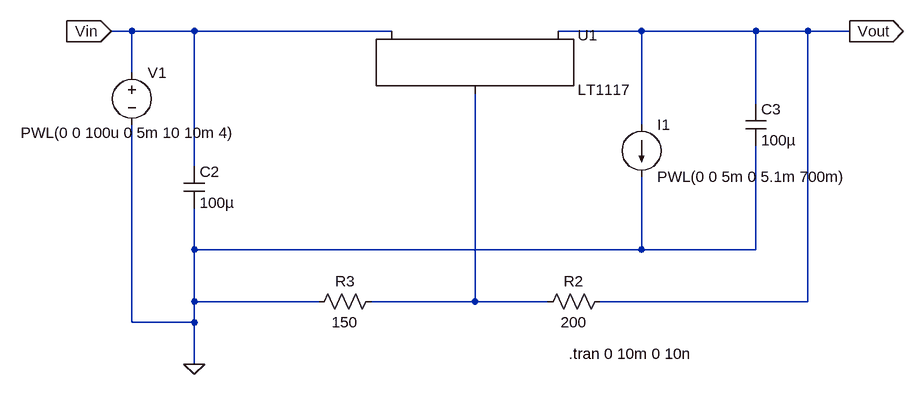
[diagram p0: schematic LT1117.asc]
LT1117.asc, the LTspice schematic file:
Version 4
SHEET 1 1312 680
WIRE -224 144 -256 144
WIRE -128 144 -224 144
WIRE 176 144 -128 144
WIRE 560 144 432 144
WIRE 736 144 560 144
WIRE 816 144 736 144
WIRE 880 144 816 144
WIRE -224 208 -224 144
WIRE 736 256 736 144
WIRE 560 288 560 144
WIRE -128 352 -128 144
WIRE -128 480 -128 416
WIRE 560 480 560 368
WIRE 560 480 -128 480
WIRE 736 480 736 320
WIRE 736 480 560 480
WIRE -128 560 -128 480
WIRE 64 560 -128 560
WIRE 304 560 304 240
WIRE 304 560 144 560
WIRE 416 560 304 560
WIRE 816 560 816 144
WIRE 816 560 496 560
WIRE -224 592 -224 288
WIRE -128 592 -128 560
WIRE -128 592 -224 592
WIRE -128 656 -128 592
FLAG -128 656 0
FLAG 880 144 Vout
IOPIN 880 144 Out
FLAG -256 144 Vin
IOPIN -256 144 In
SYMBOL cap -144 352 R0
SYMATTR InstName C2
SYMATTR Value 100µ
SYMBOL cap 720 256 R0
SYMATTR InstName C3
SYMATTR Value 100µ
SYMBOL res 512 544 R90
WINDOW 0 0 56 VBottom 2
WINDOW 3 32 56 VTop 2
SYMATTR InstName R2
SYMATTR Value 200
SYMBOL res 160 544 R90
WINDOW 0 0 56 VBottom 2
WINDOW 3 32 56 VTop 2
SYMATTR InstName R3
SYMATTR Value 150
SYMBOL voltage -224 192 R0
WINDOW 123 0 0 Left 0
WINDOW 39 0 0 Left 0
WINDOW 3 -171 108 Left 2
SYMATTR Value PWL(0 0 100u 0 5m 10 10m 4)
SYMATTR InstName V1
SYMBOL current 560 288 R0
WINDOW 123 0 0 Left 0
WINDOW 39 0 0 Left 0
SYMATTR InstName I1
SYMATTR Value PWL(0 0 5m 0 5.1m 700m)
SYMBOL PowerProducts\\LT1117 304 144 R0
SYMATTR InstName U1
TEXT 448 640 Left 2 !.tran 0 10m 0 10n

The netlist it stands for:
* LT1117.asc
C2 Vin 0 100µ
C3 Vout 0 100µ
R2 Vout N001 200
R3 N001 0 150
V1 Vin 0 PWL(0 0 100u 0 5m 10 10m 4)
I1 Vout 0 PWL(0 0 5m 0 5.1m 700m)
XU1 N001 Vout Vin LT1117
.tran 0 10m 0 10n
.lib LT1117.lib
.backanno
.end